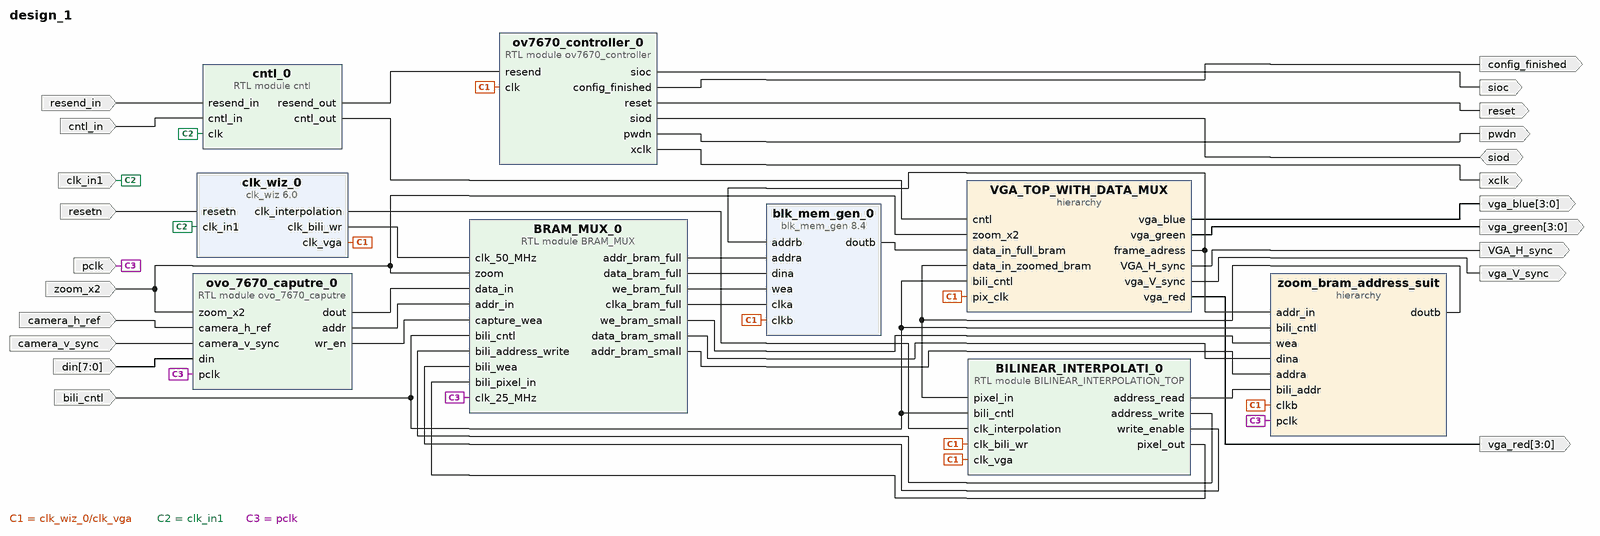
[diagram p0: block diagram of the top level]
# Vivado block design design_1, xc7a100tcsg324-1, Vivado 2019.2
create_bd_design design_1

create_bd_port -dir I -type clk clk_in1
set_property -dict {CONFIG.ASSOCIATED_RESET reset_0} [get_bd_ports clk_in1]
create_bd_port -dir I camera_h_ref
create_bd_port -dir I camera_v_sync
create_bd_port -dir I -from 7 -to 0 din
create_bd_port -dir I pclk
create_bd_port -dir O sioc
create_bd_port -dir O config_finished
create_bd_port -dir O -type rst reset
create_bd_port -dir IO siod
create_bd_port -dir O pwdn
create_bd_port -dir O xclk
create_bd_port -dir I resend_in
create_bd_port -dir I cntl_in
create_bd_port -dir I -type rst resetn
create_bd_port -dir I zoom_x2
create_bd_port -dir O vga_V_sync
create_bd_port -dir O VGA_H_sync
create_bd_port -dir O -from 3 -to 0 vga_green
create_bd_port -dir O -from 3 -to 0 vga_blue
create_bd_port -dir O -from 3 -to 0 vga_red
create_bd_port -dir I bili_cntl

create_bd_cell -type ip -vlnv xilinx.com:ip:blk_mem_gen:8.4 blk_mem_gen_0
set_property -dict [list \
  CONFIG.Assume_Synchronous_Clk true \
  CONFIG.Enable_32bit_Address false \
  CONFIG.Enable_A Always_Enabled \
  CONFIG.Enable_B Always_Enabled \
  CONFIG.Memory_Type Simple_Dual_Port_RAM \
  CONFIG.Operating_Mode_A NO_CHANGE \
  CONFIG.Port_B_Clock 100 \
  CONFIG.Port_B_Enable_Rate 100 \
  CONFIG.Read_Width_B 12 \
  CONFIG.Register_PortB_Output_of_Memory_Primitives true \
  CONFIG.Use_Byte_Write_Enable false \
  CONFIG.Write_Depth_A 307200 \
  CONFIG.Write_Width_A 12 \
  CONFIG.Write_Width_B 12 \
  CONFIG.use_bram_block Stand_Alone \
] [get_bd_cells blk_mem_gen_0]
create_bd_cell -type ip -vlnv xilinx.com:ip:clk_wiz:6.0 clk_wiz_0
set_property -dict [list \
  CONFIG.CLKOUT1_JITTER 191.696 \
  CONFIG.CLKOUT1_PHASE_ERROR 114.212 \
  CONFIG.CLKOUT1_REQUESTED_OUT_FREQ 25 \
  CONFIG.CLKOUT1_USED true \
  CONFIG.CLKOUT2_JITTER 251.196 \
  CONFIG.CLKOUT2_PHASE_ERROR 114.212 \
  CONFIG.CLKOUT2_REQUESTED_OUT_FREQ 6.25 \
  CONFIG.CLKOUT2_USED true \
  CONFIG.CLKOUT3_JITTER 167.017 \
  CONFIG.CLKOUT3_PHASE_ERROR 114.212 \
  CONFIG.CLKOUT3_REQUESTED_OUT_FREQ 50.000 \
  CONFIG.CLKOUT3_USED true \
  CONFIG.CLK_OUT1_PORT clk_vga \
  CONFIG.CLK_OUT2_PORT clk_interpolation \
  CONFIG.CLK_OUT3_PORT clk_bili_wr \
  CONFIG.MMCM_CLKFBOUT_MULT_F 8.000 \
  CONFIG.MMCM_CLKOUT0_DIVIDE_F 32.000 \
  CONFIG.MMCM_CLKOUT1_DIVIDE 128 \
  CONFIG.MMCM_CLKOUT2_DIVIDE 16 \
  CONFIG.MMCM_DIVCLK_DIVIDE 1 \
  CONFIG.NUM_OUT_CLKS 3 \
  CONFIG.RESET_PORT resetn \
  CONFIG.RESET_TYPE ACTIVE_LOW \
  CONFIG.USE_LOCKED false \
] [get_bd_cells clk_wiz_0]
create_bd_cell -type hier zoom_bram_address_suit
create_bd_cell -type hier VGA_TOP_WITH_DATA_MUX
create_bd_cell -type module -reference BRAM_MUX BRAM_MUX_0
create_bd_cell -type module -reference BILINEAR_INTERPOLATION_TOP BILINEAR_INTERPOLATI_0
create_bd_cell -type module -reference ov7670_controller ov7670_controller_0
create_bd_cell -type module -reference cntl cntl_0
create_bd_cell -type module -reference ovo_7670_caputre ovo_7670_caputre_0

# ---- hierarchy /zoom_bram_address_suit ----
current_bd_instance /zoom_bram_address_suit
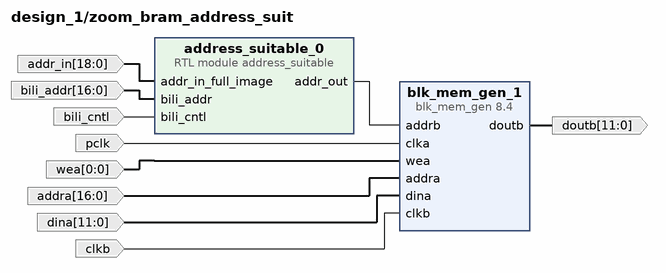
[diagram p1: block diagram inside /zoom_bram_address_suit]
create_bd_pin -dir I -type clk pclk
create_bd_pin -dir I -from 0 -to 0 wea
create_bd_pin -dir I -from 16 -to 0 addra
create_bd_pin -dir I -from 11 -to 0 dina
create_bd_pin -dir I -type clk clkb
create_bd_pin -dir O -from 11 -to 0 doutb
create_bd_pin -dir I -from 18 -to 0 addr_in
create_bd_pin -dir I -from 16 -to 0 bili_addr
create_bd_pin -dir I bili_cntl

create_bd_cell -type ip -vlnv xilinx.com:ip:blk_mem_gen:8.4 blk_mem_gen_1
set_property -dict [list \
  CONFIG.Assume_Synchronous_Clk true \
  CONFIG.Enable_32bit_Address false \
  CONFIG.Enable_A Always_Enabled \
  CONFIG.Enable_B Always_Enabled \
  CONFIG.Memory_Type Simple_Dual_Port_RAM \
  CONFIG.Operating_Mode_A NO_CHANGE \
  CONFIG.Port_B_Clock 100 \
  CONFIG.Port_B_Enable_Rate 100 \
  CONFIG.Read_Width_B 12 \
  CONFIG.Register_PortB_Output_of_Memory_Primitives true \
  CONFIG.Use_Byte_Write_Enable false \
  CONFIG.Write_Depth_A 76800 \
  CONFIG.Write_Width_A 12 \
  CONFIG.Write_Width_B 12 \
  CONFIG.use_bram_block Stand_Alone \
] [get_bd_cells blk_mem_gen_1]
create_bd_cell -type module -reference address_suitable address_suitable_0

# ---- hierarchy /VGA_TOP_WITH_DATA_MUX ----
current_bd_instance /VGA_TOP_WITH_DATA_MUX
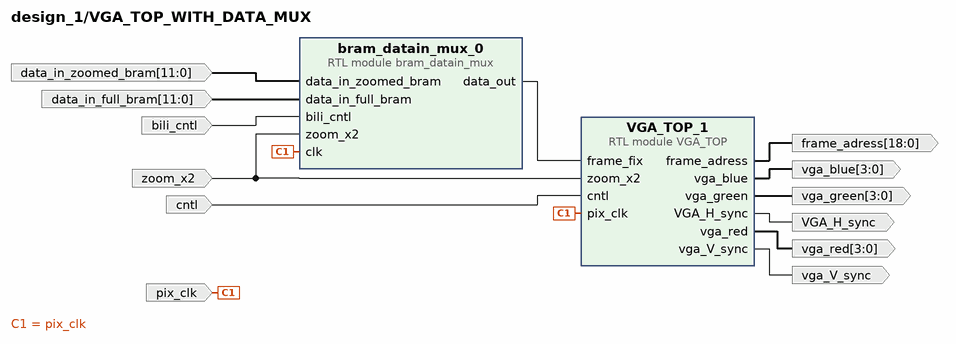
[diagram p2: block diagram inside /VGA_TOP_WITH_DATA_MUX]
create_bd_pin -dir I -type clk pix_clk
create_bd_pin -dir I zoom_x2
create_bd_pin -dir I -from 11 -to 0 data_in_zoomed_bram
create_bd_pin -dir I -from 11 -to 0 data_in_full_bram
create_bd_pin -dir I cntl
create_bd_pin -dir O VGA_H_sync
create_bd_pin -dir O vga_V_sync
create_bd_pin -dir O -from 3 -to 0 vga_red
create_bd_pin -dir O -from 3 -to 0 vga_blue
create_bd_pin -dir O -from 3 -to 0 vga_green
create_bd_pin -dir O -from 18 -to 0 frame_adress
create_bd_pin -dir I bili_cntl

create_bd_cell -type module -reference bram_datain_mux bram_datain_mux_0
create_bd_cell -type module -reference VGA_TOP VGA_TOP_1

# ---- connections ----

current_bd_instance /zoom_bram_address_suit
connect_bd_net [get_bd_pins address_suitable_0/addr_out] [get_bd_pins blk_mem_gen_1/addrb]
connect_bd_net -net pclk_0_1 [get_bd_pins pclk] [get_bd_pins blk_mem_gen_1/clka]
connect_bd_net -net BRAM_MUX_0_we_bram2 [get_bd_pins wea] [get_bd_pins blk_mem_gen_1/wea]
connect_bd_net -net BRAM_MUX_0_addr_bram2 [get_bd_pins addra] [get_bd_pins blk_mem_gen_1/addra]
connect_bd_net -net BRAM_MUX_0_data_bram2 [get_bd_pins dina] [get_bd_pins blk_mem_gen_1/dina]
connect_bd_net -net clk_wiz_0_clk_vga [get_bd_pins clkb] [get_bd_pins blk_mem_gen_1/clkb]
connect_bd_net -net VGA_TOP_1_frame_adress [get_bd_pins addr_in] [get_bd_pins address_suitable_0/addr_in_full_image]
connect_bd_net [get_bd_pins bili_addr] [get_bd_pins address_suitable_0/bili_addr]
connect_bd_net [get_bd_pins bili_cntl] [get_bd_pins address_suitable_0/bili_cntl]
connect_bd_net [get_bd_pins blk_mem_gen_1/doutb] [get_bd_pins doutb]

current_bd_instance /VGA_TOP_WITH_DATA_MUX
connect_bd_net [get_bd_pins bram_datain_mux_0/data_out] [get_bd_pins VGA_TOP_1/frame_fix]
connect_bd_net -net clk_wiz_0_clk_vga [get_bd_pins pix_clk] [get_bd_pins bram_datain_mux_0/clk] [get_bd_pins VGA_TOP_1/pix_clk]
connect_bd_net -net zoom_x2_0_1 [get_bd_pins zoom_x2] [get_bd_pins bram_datain_mux_0/zoom_x2] [get_bd_pins VGA_TOP_1/zoom_x2]
connect_bd_net -net blk_mem_gen_1_doutb [get_bd_pins data_in_zoomed_bram] [get_bd_pins bram_datain_mux_0/data_in_zoomed_bram]
connect_bd_net -net blk_mem_gen_0_doutb [get_bd_pins data_in_full_bram] [get_bd_pins bram_datain_mux_0/data_in_full_bram]
connect_bd_net -net cntl_0_cntl_out [get_bd_pins cntl] [get_bd_pins VGA_TOP_1/cntl]
connect_bd_net [get_bd_pins VGA_TOP_1/VGA_H_sync] [get_bd_pins VGA_H_sync]
connect_bd_net [get_bd_pins VGA_TOP_1/vga_V_sync] [get_bd_pins vga_V_sync]
connect_bd_net [get_bd_pins VGA_TOP_1/vga_red] [get_bd_pins vga_red]
connect_bd_net [get_bd_pins VGA_TOP_1/vga_blue] [get_bd_pins vga_blue]
connect_bd_net [get_bd_pins VGA_TOP_1/vga_green] [get_bd_pins vga_green]
connect_bd_net [get_bd_pins VGA_TOP_1/frame_adress] [get_bd_pins frame_adress]
connect_bd_net [get_bd_pins bili_cntl] [get_bd_pins bram_datain_mux_0/bili_cntl]

current_bd_instance /
connect_bd_net [get_bd_pins cntl_0/resend_out] [get_bd_pins ov7670_controller_0/resend]
connect_bd_net -net camera_h_ref_0_1 [get_bd_ports camera_h_ref] [get_bd_pins ovo_7670_caputre_0/camera_h_ref]
connect_bd_net -net camera_v_sync_0_1 [get_bd_ports camera_v_sync] [get_bd_pins ovo_7670_caputre_0/camera_v_sync]
connect_bd_net -net din_0_1 [get_bd_ports din] [get_bd_pins ovo_7670_caputre_0/din]
connect_bd_net [get_bd_pins ov7670_controller_0/sioc] [get_bd_ports sioc]
connect_bd_net [get_bd_pins ov7670_controller_0/config_finished] [get_bd_ports config_finished]
connect_bd_net [get_bd_pins ov7670_controller_0/reset] [get_bd_ports reset]
connect_bd_net [get_bd_ports siod] [get_bd_pins ov7670_controller_0/siod]
connect_bd_net [get_bd_pins ov7670_controller_0/pwdn] [get_bd_ports pwdn]
connect_bd_net [get_bd_pins ov7670_controller_0/xclk] [get_bd_ports xclk]
connect_bd_net -net resend_in_0_1 [get_bd_ports resend_in] [get_bd_pins cntl_0/resend_in]
connect_bd_net -net cntl_in_0_1 [get_bd_ports cntl_in] [get_bd_pins cntl_0/cntl_in]
connect_bd_net -net resetn_0_1 [get_bd_ports resetn] [get_bd_pins clk_wiz_0/resetn]
connect_bd_net -net zoom_x2_0_1 [get_bd_ports zoom_x2] \
  [get_bd_pins VGA_TOP_WITH_DATA_MUX/zoom_x2] [get_bd_pins BRAM_MUX_0/zoom] [get_bd_pins ovo_7670_caputre_0/zoom_x2]
connect_bd_net -net VGA_TOP_1_vga_V_sync [get_bd_pins VGA_TOP_WITH_DATA_MUX/vga_V_sync] [get_bd_ports vga_V_sync]
connect_bd_net -net VGA_TOP_1_VGA_H_sync [get_bd_pins VGA_TOP_WITH_DATA_MUX/VGA_H_sync] [get_bd_ports VGA_H_sync]
connect_bd_net -net VGA_TOP_1_vga_green [get_bd_pins VGA_TOP_WITH_DATA_MUX/vga_green] [get_bd_ports vga_green]
connect_bd_net -net VGA_TOP_1_vga_blue [get_bd_pins VGA_TOP_WITH_DATA_MUX/vga_blue] [get_bd_ports vga_blue]
connect_bd_net -net VGA_TOP_1_vga_red [get_bd_pins VGA_TOP_WITH_DATA_MUX/vga_red] [get_bd_ports vga_red]
connect_bd_net [get_bd_pins cntl_0/cntl_out] [get_bd_pins VGA_TOP_WITH_DATA_MUX/cntl]
connect_bd_net [get_bd_pins ovo_7670_caputre_0/dout] [get_bd_pins BRAM_MUX_0/data_in]
connect_bd_net -net BRAM_MUX_0_addr_bram1 [get_bd_pins BRAM_MUX_0/addr_bram_full] [get_bd_pins blk_mem_gen_0/addra]
connect_bd_net -net BRAM_MUX_0_data_bram1 [get_bd_pins BRAM_MUX_0/data_bram_full] [get_bd_pins blk_mem_gen_0/dina]
connect_bd_net -net BRAM_MUX_0_we_bram2 [get_bd_pins BRAM_MUX_0/we_bram_small] [get_bd_pins zoom_bram_address_suit/wea]
connect_bd_net -net BRAM_MUX_0_data_bram2 [get_bd_pins BRAM_MUX_0/data_bram_small] [get_bd_pins zoom_bram_address_suit/dina]
connect_bd_net -net BRAM_MUX_0_we_bram1 [get_bd_pins BRAM_MUX_0/we_bram_full] [get_bd_pins blk_mem_gen_0/wea]
connect_bd_net [get_bd_pins blk_mem_gen_0/doutb] [get_bd_pins VGA_TOP_WITH_DATA_MUX/data_in_full_bram]
connect_bd_net -net blk_mem_gen_1_doutb [get_bd_pins zoom_bram_address_suit/doutb] \
  [get_bd_pins VGA_TOP_WITH_DATA_MUX/data_in_zoomed_bram] [get_bd_pins BILINEAR_INTERPOLATI_0/pixel_in]
connect_bd_net [get_bd_pins ovo_7670_caputre_0/addr] [get_bd_pins BRAM_MUX_0/addr_in]
connect_bd_net -net VGA_TOP_1_frame_adress [get_bd_pins VGA_TOP_WITH_DATA_MUX/frame_adress] \
  [get_bd_pins blk_mem_gen_0/addrb] [get_bd_pins zoom_bram_address_suit/addr_in]
connect_bd_net [get_bd_pins ovo_7670_caputre_0/wr_en] [get_bd_pins BRAM_MUX_0/capture_wea]
connect_bd_net -net addra_1 [get_bd_pins BRAM_MUX_0/addr_bram_small] [get_bd_pins zoom_bram_address_suit/addra]
connect_bd_net [get_bd_pins clk_wiz_0/clk_vga] \
  [get_bd_pins zoom_bram_address_suit/clkb] [get_bd_pins blk_mem_gen_0/clkb] [get_bd_pins VGA_TOP_WITH_DATA_MUX/pix_clk] \
  [get_bd_pins BILINEAR_INTERPOLATI_0/clk_vga] [get_bd_pins ov7670_controller_0/clk] \
  [get_bd_pins BILINEAR_INTERPOLATI_0/clk_bili_wr]
connect_bd_net [get_bd_ports bili_cntl] \
  [get_bd_pins zoom_bram_address_suit/bili_cntl] [get_bd_pins VGA_TOP_WITH_DATA_MUX/bili_cntl] \
  [get_bd_pins BRAM_MUX_0/bili_cntl] [get_bd_pins BILINEAR_INTERPOLATI_0/bili_cntl]
connect_bd_net [get_bd_pins clk_wiz_0/clk_interpolation] [get_bd_pins BILINEAR_INTERPOLATI_0/clk_interpolation]
connect_bd_net [get_bd_pins BILINEAR_INTERPOLATI_0/address_write] [get_bd_pins BRAM_MUX_0/bili_address_write]
connect_bd_net [get_bd_pins BILINEAR_INTERPOLATI_0/write_enable] [get_bd_pins BRAM_MUX_0/bili_wea]
connect_bd_net [get_bd_pins BILINEAR_INTERPOLATI_0/pixel_out] [get_bd_pins BRAM_MUX_0/bili_pixel_in]
connect_bd_net [get_bd_pins BILINEAR_INTERPOLATI_0/address_read] [get_bd_pins zoom_bram_address_suit/bili_addr]
connect_bd_net [get_bd_pins clk_wiz_0/clk_bili_wr] [get_bd_pins BRAM_MUX_0/clk_50_MHz]
connect_bd_net -net clk_in1_1 [get_bd_ports clk_in1] [get_bd_pins clk_wiz_0/clk_in1] [get_bd_pins cntl_0/clk]
connect_bd_net [get_bd_ports pclk] [get_bd_pins zoom_bram_address_suit/pclk] [get_bd_pins BRAM_MUX_0/clk_25_MHz] [get_bd_pins ovo_7670_caputre_0/pclk]
connect_bd_net [get_bd_pins BRAM_MUX_0/clka_bram_full] [get_bd_pins blk_mem_gen_0/clka]

validate_bd_design
save_bd_design
